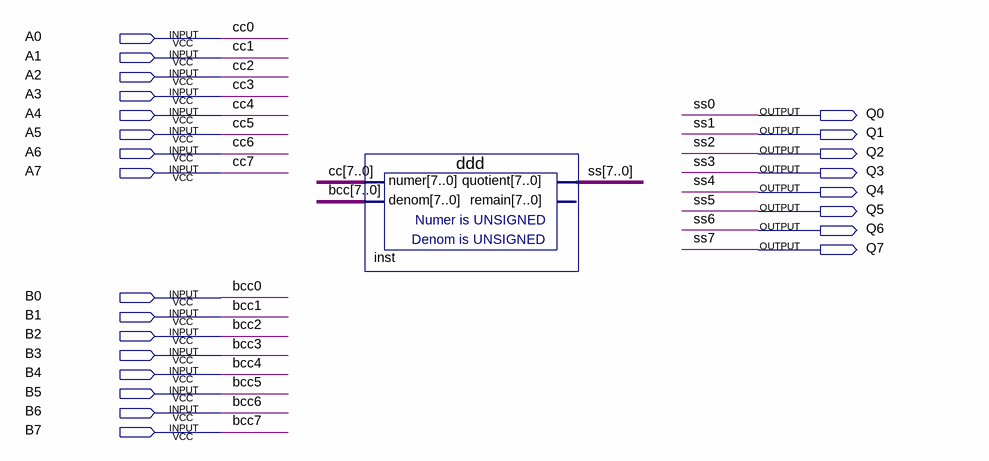
[diagram p0: schematic sheet]
// Quartus schematic div.bdf as structural Verilog: 1 symbols, 24 pins
module div (
  input  A0,
  input  A1,
  input  A2,
  input  A3,
  input  A4,
  input  A5,
  input  A6,
  input  A7,
  input  B0,
  input  B1,
  input  B2,
  input  B3,
  input  B4,
  input  B5,
  input  B6,
  input  B7,
  output Q0,
  output Q1,
  output Q2,
  output Q3,
  output Q4,
  output Q5,
  output Q6,
  output Q7
);

  ddd inst (
    .numer({A7, A6, A5, A4, A3, A2, A1, A0}), .denom({B7, B6, B5, B4, B3, B2, B1, B0}),
    .quotient({Q7, Q6, Q5, Q4, Q3, Q2, Q1, Q0}));  // open: remain

  // Other names for the same wires on the sheet: bcc[7:0] = {B7, B6, B5, B4, B3, B2, B1, B0}; bcc0 = B0; bcc1 = B1;
  //   bcc2 = B2; bcc3 = B3; bcc4 = B4; bcc5 = B5; bcc6 = B6; bcc7 = B7; cc[7:0] = {A7, A6, A5, A4, A3, A2, A1, A0};
  //   cc0 = A0; cc1 = A1; cc2 = A2; cc3 = A3; cc4 = A4; cc5 = A5; cc6 = A6; cc7 = A7;
  //   ss[7:0] = {Q7, Q6, Q5, Q4, Q3, Q2, Q1, Q0}; ss0 = Q0; ss1 = Q1; ss2 = Q2; ss3 = Q3; ss4 = Q4; ss5 = Q5;
  //   ss6 = Q6; ss7 = Q7
endmodule
